# Altium schematic sheet FPGA_interface.SchDoc
size A
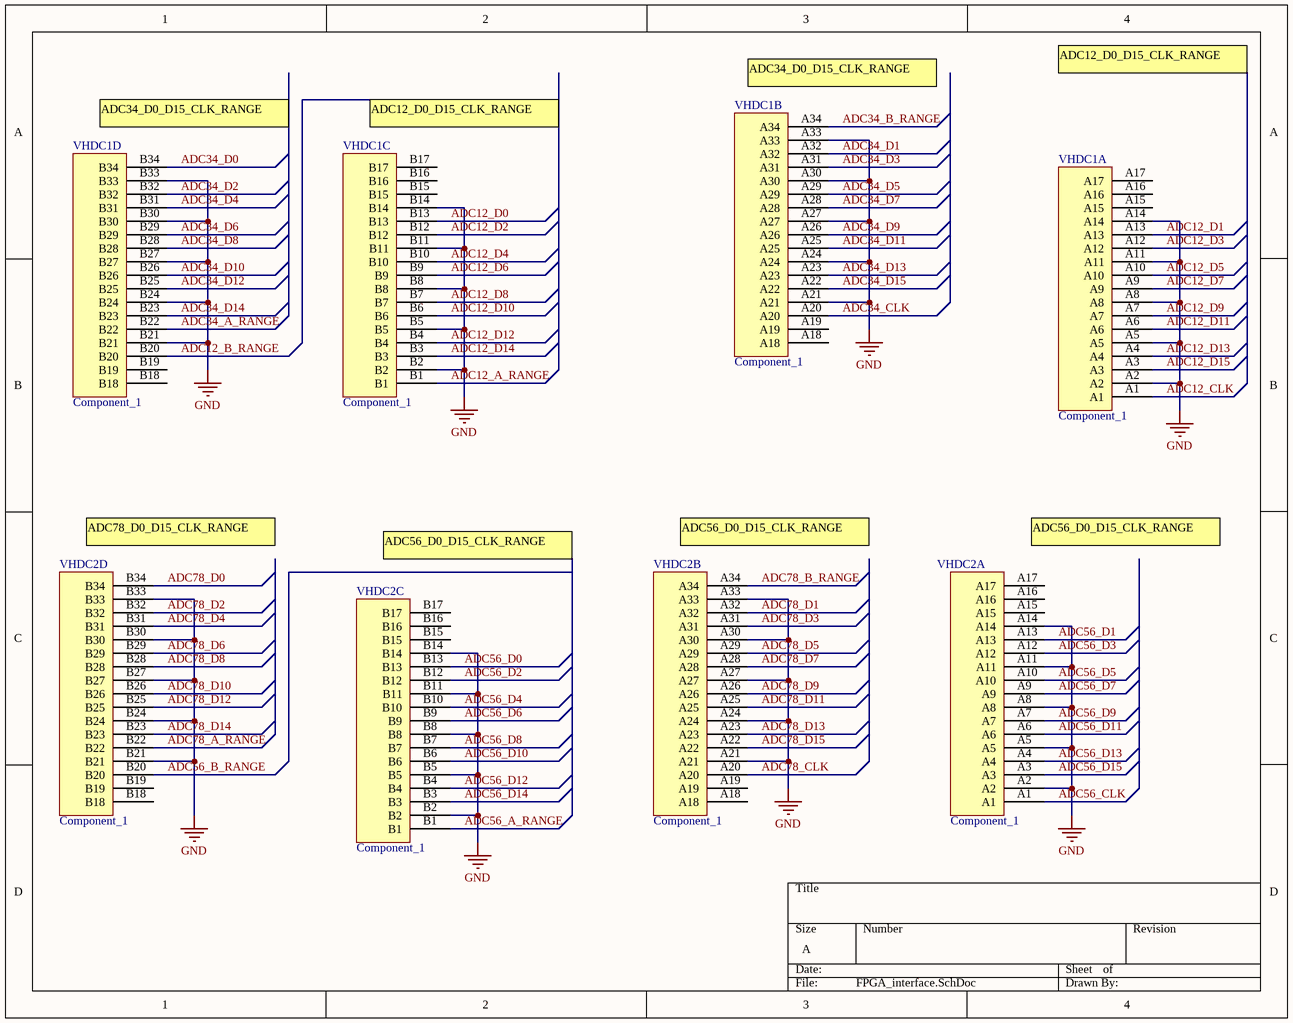
[diagram p0: FPGA_interface.SchDoc]

## Parts
VHDC1  Component_1  [VHDCP-68-01-M-EM: PLUG]  (parts A,B,C,D of 4)
VHDC2  Component_1  [VHDCP-68-01-M-EM: PLUG]  (parts A,B,C,D of 4)

## Nets
GND: VHDC1.A2 VHDC1.A5 VHDC1.A8 VHDC1.A11 VHDC1.A14 VHDC1.A21 VHDC1.A24 VHDC1.A27 VHDC1.A30 VHDC1.A33 VHDC1.B2 VHDC1.B5 VHDC1.B8 VHDC1.B11 VHDC1.B14 VHDC1.B21 VHDC1.B24 VHDC1.B27 VHDC1.B30 VHDC1.B33 VHDC2.A2 VHDC2.A5 VHDC2.A8 VHDC2.A11 VHDC2.A14 VHDC2.A21 VHDC2.A24 VHDC2.A27 VHDC2.A30 VHDC2.A33 VHDC2.B2 VHDC2.B5 VHDC2.B8 VHDC2.B11 VHDC2.B14 VHDC2.B21 VHDC2.B24 VHDC2.B27 VHDC2.B30 VHDC2.B33
ADC12_A_RANGE: VHDC1.B1
ADC12_B_RANGE: VHDC1.B20
ADC12_CLK: VHDC1.A1
ADC12_D0: VHDC1.B13
ADC12_D1: VHDC1.A13
ADC12_D2: VHDC1.B12
ADC12_D3: VHDC1.A12
ADC12_D4: VHDC1.B10
ADC12_D5: VHDC1.A10
ADC12_D6: VHDC1.B9
ADC12_D7: VHDC1.A9
ADC12_D8: VHDC1.B7
ADC12_D9: VHDC1.A7
ADC12_D10: VHDC1.B6
ADC12_D11: VHDC1.A6
ADC12_D12: VHDC1.B4
ADC12_D13: VHDC1.A4
ADC12_D14: VHDC1.B3
ADC12_D15: VHDC1.A3
ADC34_A_RANGE: VHDC1.B22
ADC34_B_RANGE: VHDC1.A34
ADC34_CLK: VHDC1.A20
ADC34_D0: VHDC1.B34
ADC34_D1: VHDC1.A32
ADC34_D2: VHDC1.B32
ADC34_D3: VHDC1.A31
ADC34_D4: VHDC1.B31
ADC34_D5: VHDC1.A29
ADC34_D6: VHDC1.B29
ADC34_D7: VHDC1.A28
ADC34_D8: VHDC1.B28
ADC34_D9: VHDC1.A26
ADC34_D10: VHDC1.B26
ADC34_D11: VHDC1.A25
ADC34_D12: VHDC1.B25
ADC34_D13: VHDC1.A23
ADC34_D14: VHDC1.B23
ADC34_D15: VHDC1.A22
ADC56_A_RANGE: VHDC2.B1
ADC56_B_RANGE: VHDC2.B20
ADC56_CLK: VHDC2.A1
ADC56_D0: VHDC2.B13
ADC56_D1: VHDC2.A13
ADC56_D2: VHDC2.B12
ADC56_D3: VHDC2.A12
ADC56_D4: VHDC2.B10
ADC56_D5: VHDC2.A10
ADC56_D6: VHDC2.B9
ADC56_D7: VHDC2.A9
ADC56_D8: VHDC2.B7
ADC56_D9: VHDC2.A7
ADC56_D10: VHDC2.B6
ADC56_D11: VHDC2.A6
ADC56_D12: VHDC2.B4
ADC56_D13: VHDC2.A4
ADC56_D14: VHDC2.B3
ADC56_D15: VHDC2.A3
ADC78_A_RANGE: VHDC2.B22
ADC78_B_RANGE: VHDC2.A34
ADC78_CLK: VHDC2.A20
ADC78_D0: VHDC2.B34
ADC78_D1: VHDC2.A32
ADC78_D2: VHDC2.B32
ADC78_D3: VHDC2.A31
ADC78_D4: VHDC2.B31
ADC78_D5: VHDC2.A29
ADC78_D6: VHDC2.B29
ADC78_D7: VHDC2.A28
ADC78_D8: VHDC2.B28
ADC78_D9: VHDC2.A26
ADC78_D10: VHDC2.B26
ADC78_D11: VHDC2.A25
ADC78_D12: VHDC2.B25
ADC78_D13: VHDC2.A23
ADC78_D14: VHDC2.B23
ADC78_D15: VHDC2.A22

Not connected (* = marked no-connect by the designer): VHDC1 A15 A16 A17 A18 A19 B15 B16 B17 B18 B19; VHDC2 A15 A16 A17 A18 A19 B15 B16 B17 B18 B19

## Notes on the sheet
- (near VHDC1) ADC34_D0_D15_CLK_RANGE
- ADC12_D0_D15_CLK_RANGE
- (near VHDC1) ADC12_D0_D15_CLK_RANGE
- (near VHDC2) ADC78_D0_D15_CLK_RANGE
- ADC56_D0_D15_CLK_RANGE
- (near VHDC2) ADC56_D0_D15_CLK_RANGE

## Library data of the parts
VHDC1 VHDC2 = Component_1: VHDC_connector